# Altium schematic sheet MPU6050.SchDoc
size A; SheetNumber: 6; SheetTotal: 7
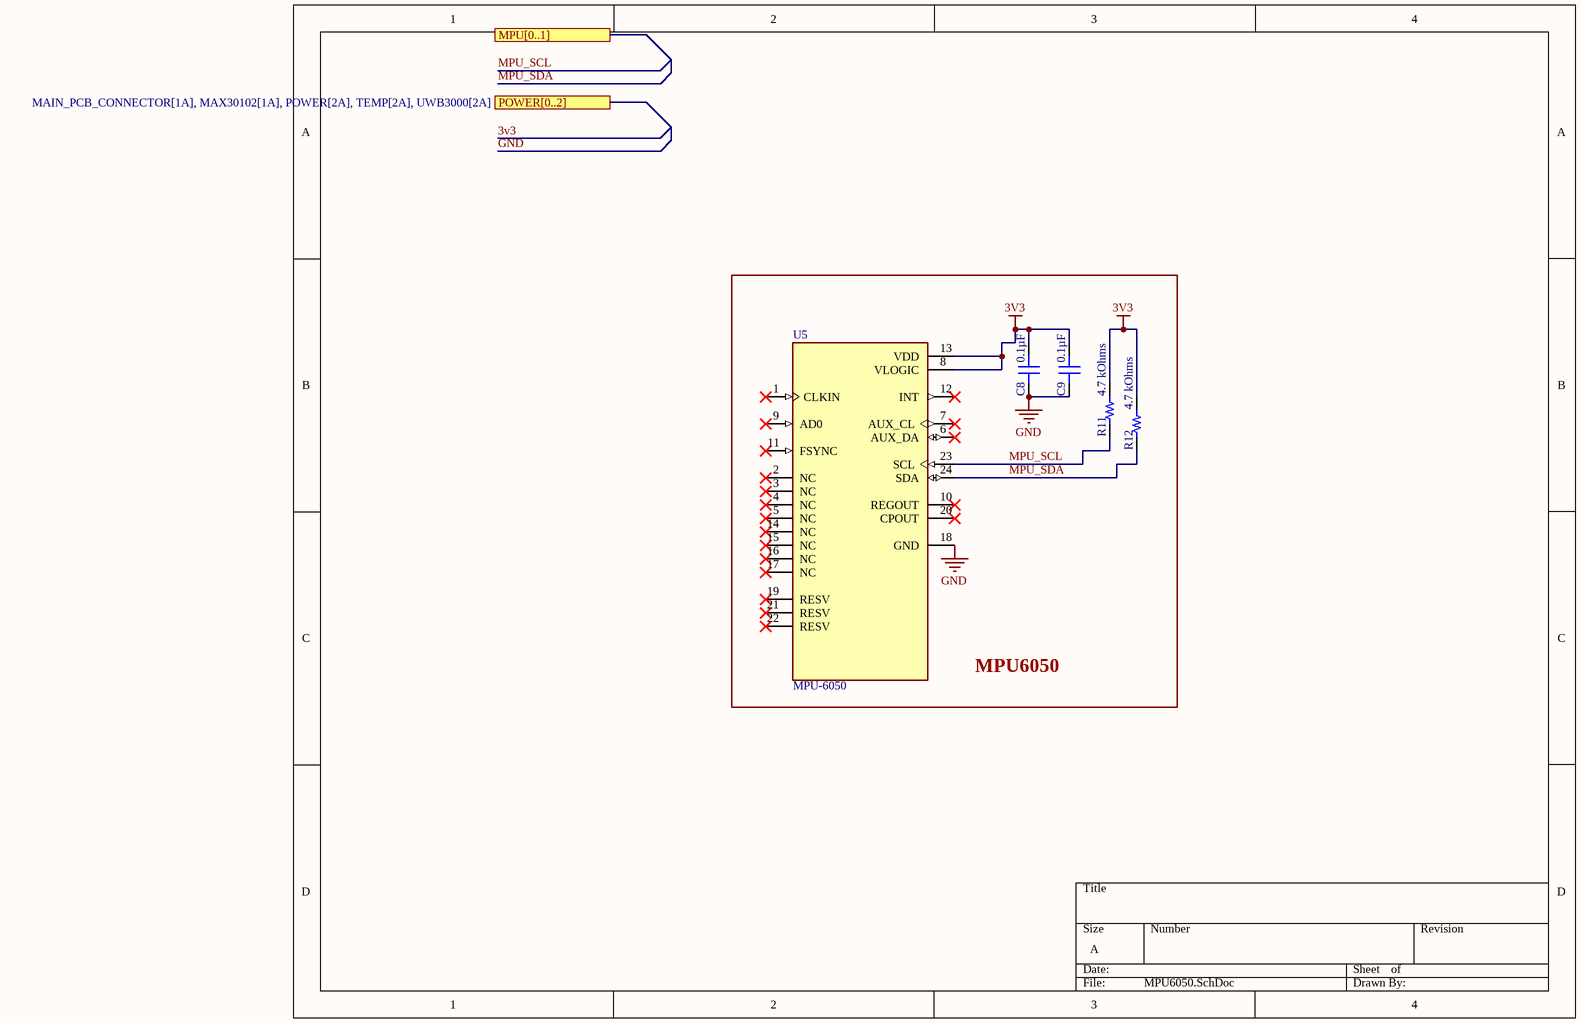
[diagram p0: MPU6050.SchDoc]

## Parts
C8  0.1µF  [CAP 0402_1005]
C9  0.1µF  [CAP 0402_1005]
R11  4.7 kOhms  [YAGEO RES 0402_1005]
R12  4.7 kOhms  [YAGEO RES 0402_1005]
U5  MPU-6050  [QFN50P400X400X95-24N]

## Ports
MPU[0..1], POWER[0..2] (see MAIN_PCB_CONNECTOR[1A], MAX30102[1A], POWER[2A], TEMP[2A], UWB3000[2A])

## Nets
3v3: C8.2 C9.2 R11.2 R12.2 U5.8(VLOGIC) U5.13(VDD)
GND: C8.1 C9.1 U5.18(GND)
MPU_SCL: R11.1 U5.23(SCL)
MPU_SDA: R12.1 U5.24(SDA)

Not connected (* = marked no-connect by the designer): U5 1(CLKIN)* 2(NC)* 3(NC)* 4(NC)* 5(NC)* 6(AUX_DA)* 7(AUX_CL)* 9(AD0)* 10(REGOUT)* 11(FSYNC)* 12(INT)* 14(NC)* 15(NC)* 16(NC)* 17(NC)* 19(RESV)* 20(CPOUT)* 21(RESV)* 22(RESV)*

## Notes on the sheet
- MPU6050

## Library data of the parts
C8 C9 = 0402ZG104ZAT2A: CAP CER 0.1UF 10V Y5V 0402; MF: AVX Corporation; Temperature Coefficient: Y5V (F); Tolerance: -20%, +80%; MP: 0402ZG104ZAT2A; Capacitance: 0.1µF; Applications: General Purpose; componentlink1description: Datasheet; componentlink1url: http://datasheets.avx.com/Y5V.pdf; componentlink2description: DigiKey Link; componentlink2url: http://digikey.com/product-detail/en/avx-corporation/0402ZG104ZAT2A/478-10182-1-ND/6797600; Device Package: 0402 (1005 Metric); lastupdated: 2/8/2022 12:26:49 PM; Lifecycle Status: Active; Minimum Order: 1; Mounting Type: Surface Mount, MLCC; Operating Temperature: -30°C ~ 85°C; Package / Case: 0402 (1005 Metric); packaging: TapeAndReel; partid: 7852; Part Status: Active; price: 0.01; series: -; Size / Dimension: 0.039" L x 0.020" W (1.00mm x 0.50mm); Supplier 1: DigiKey; Supplier Part Number 1: 478-10182-1-ND; Thickness (Max): 0.022" (0.56mm); value: 0.1µF; Voltage - Rated: 10V
R11 R12 = RT0402FRE074K7L: RES SMD 4.7K OHM 1% 1/16W 0402; MF: Yageo; Power (Watts): 0.063W, 1/16W; Temperature Coefficient: ±50ppm/°C; MP: RT0402FRE074K7L; Value: 4.7 kOhms; ComponentLink1Description: Datasheet; ComponentLink1URL: https://www.yageo.com/upload/media/product/productsearch/datasheet/rchip/PYu-RT_1-to-0.01_RoHS_L_11.pdf; ComponentLink2Description: DigiKey Link; ComponentLink2URL: https://www.digikey.com/en/products/detail/yageo/RT0402FRE074K7L/1072052; Composition: Thin Film; Device Package: 0402 (1005 Metric); Height - Seated (Max): 0.014" (0.35mm); LastUpdated: 7/25/2024 9:18:18 AM; Lifecycle Status: Active; Minimum Order: 1; Number of Terminations: 2; Operating Temperature: -55°C ~ 155°C; Package / Case: 0402 (1005 Metric); Packaging: TapeAndReel; PartId: 3198; Part Status: Active; Price: 0.01; Resistance: 4.7 kOhms; Series: RT; Size / Dimension: 0.039" L x 0.020" W (1.00mm x 0.50mm); Supplier 1: DigiKey; Supplier Part Number 1: YAG3347CT-ND; Supplier Device Package: 0402; Tolerance: ±1%
U5 = MPU-6050: MPU-6050 series Accelerometer, Gyroscope, 3 Axis Sensor Evaluation Board; MF: TDK InvenSense; SnapEDA_Link: https://www.snapeda.com/parts/MPU-6050/TDK+InvenSense/view-part/?ref=snap; Package: QFN-24 InvenSense; Value: *; MP: MPU-6050; Check_prices: https://www.snapeda.com/parts/MPU-6050/TDK+InvenSense/view-part/?ref=eda